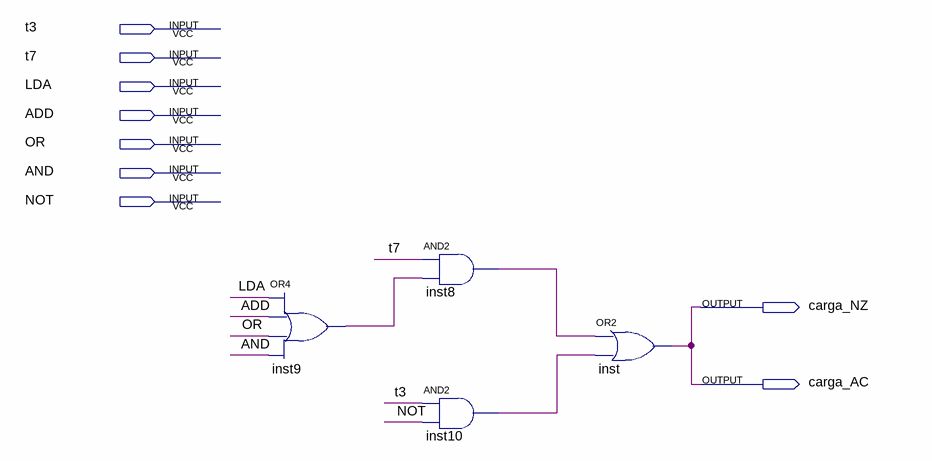
[diagram p0: schematic sheet]
// Quartus schematic carga_AC.bdf as structural Verilog: 4 symbols, 9 pins
module carga_AC (
  input  t3,
  input  t7,
  input  LDA,
  input  ADD,
  input  OR,
  input  AND,
  input  NOT,
  output carga_NZ,
  output carga_AC
);

  wire inst8_out, inst9_out, inst10_out;

  or inst9 (inst9_out, LDA, ADD, OR, AND);
  and inst8 (inst8_out, t7, inst9_out);
  and inst10 (inst10_out, t3, NOT);
  or inst (carga_AC, inst8_out, inst10_out);

  assign carga_NZ = carga_AC;
endmodule
